# Altium schematic sheet [08]-PumpDriverUnit.SchDoc: RS232 and RS422/RS485 (part 3 of 3)
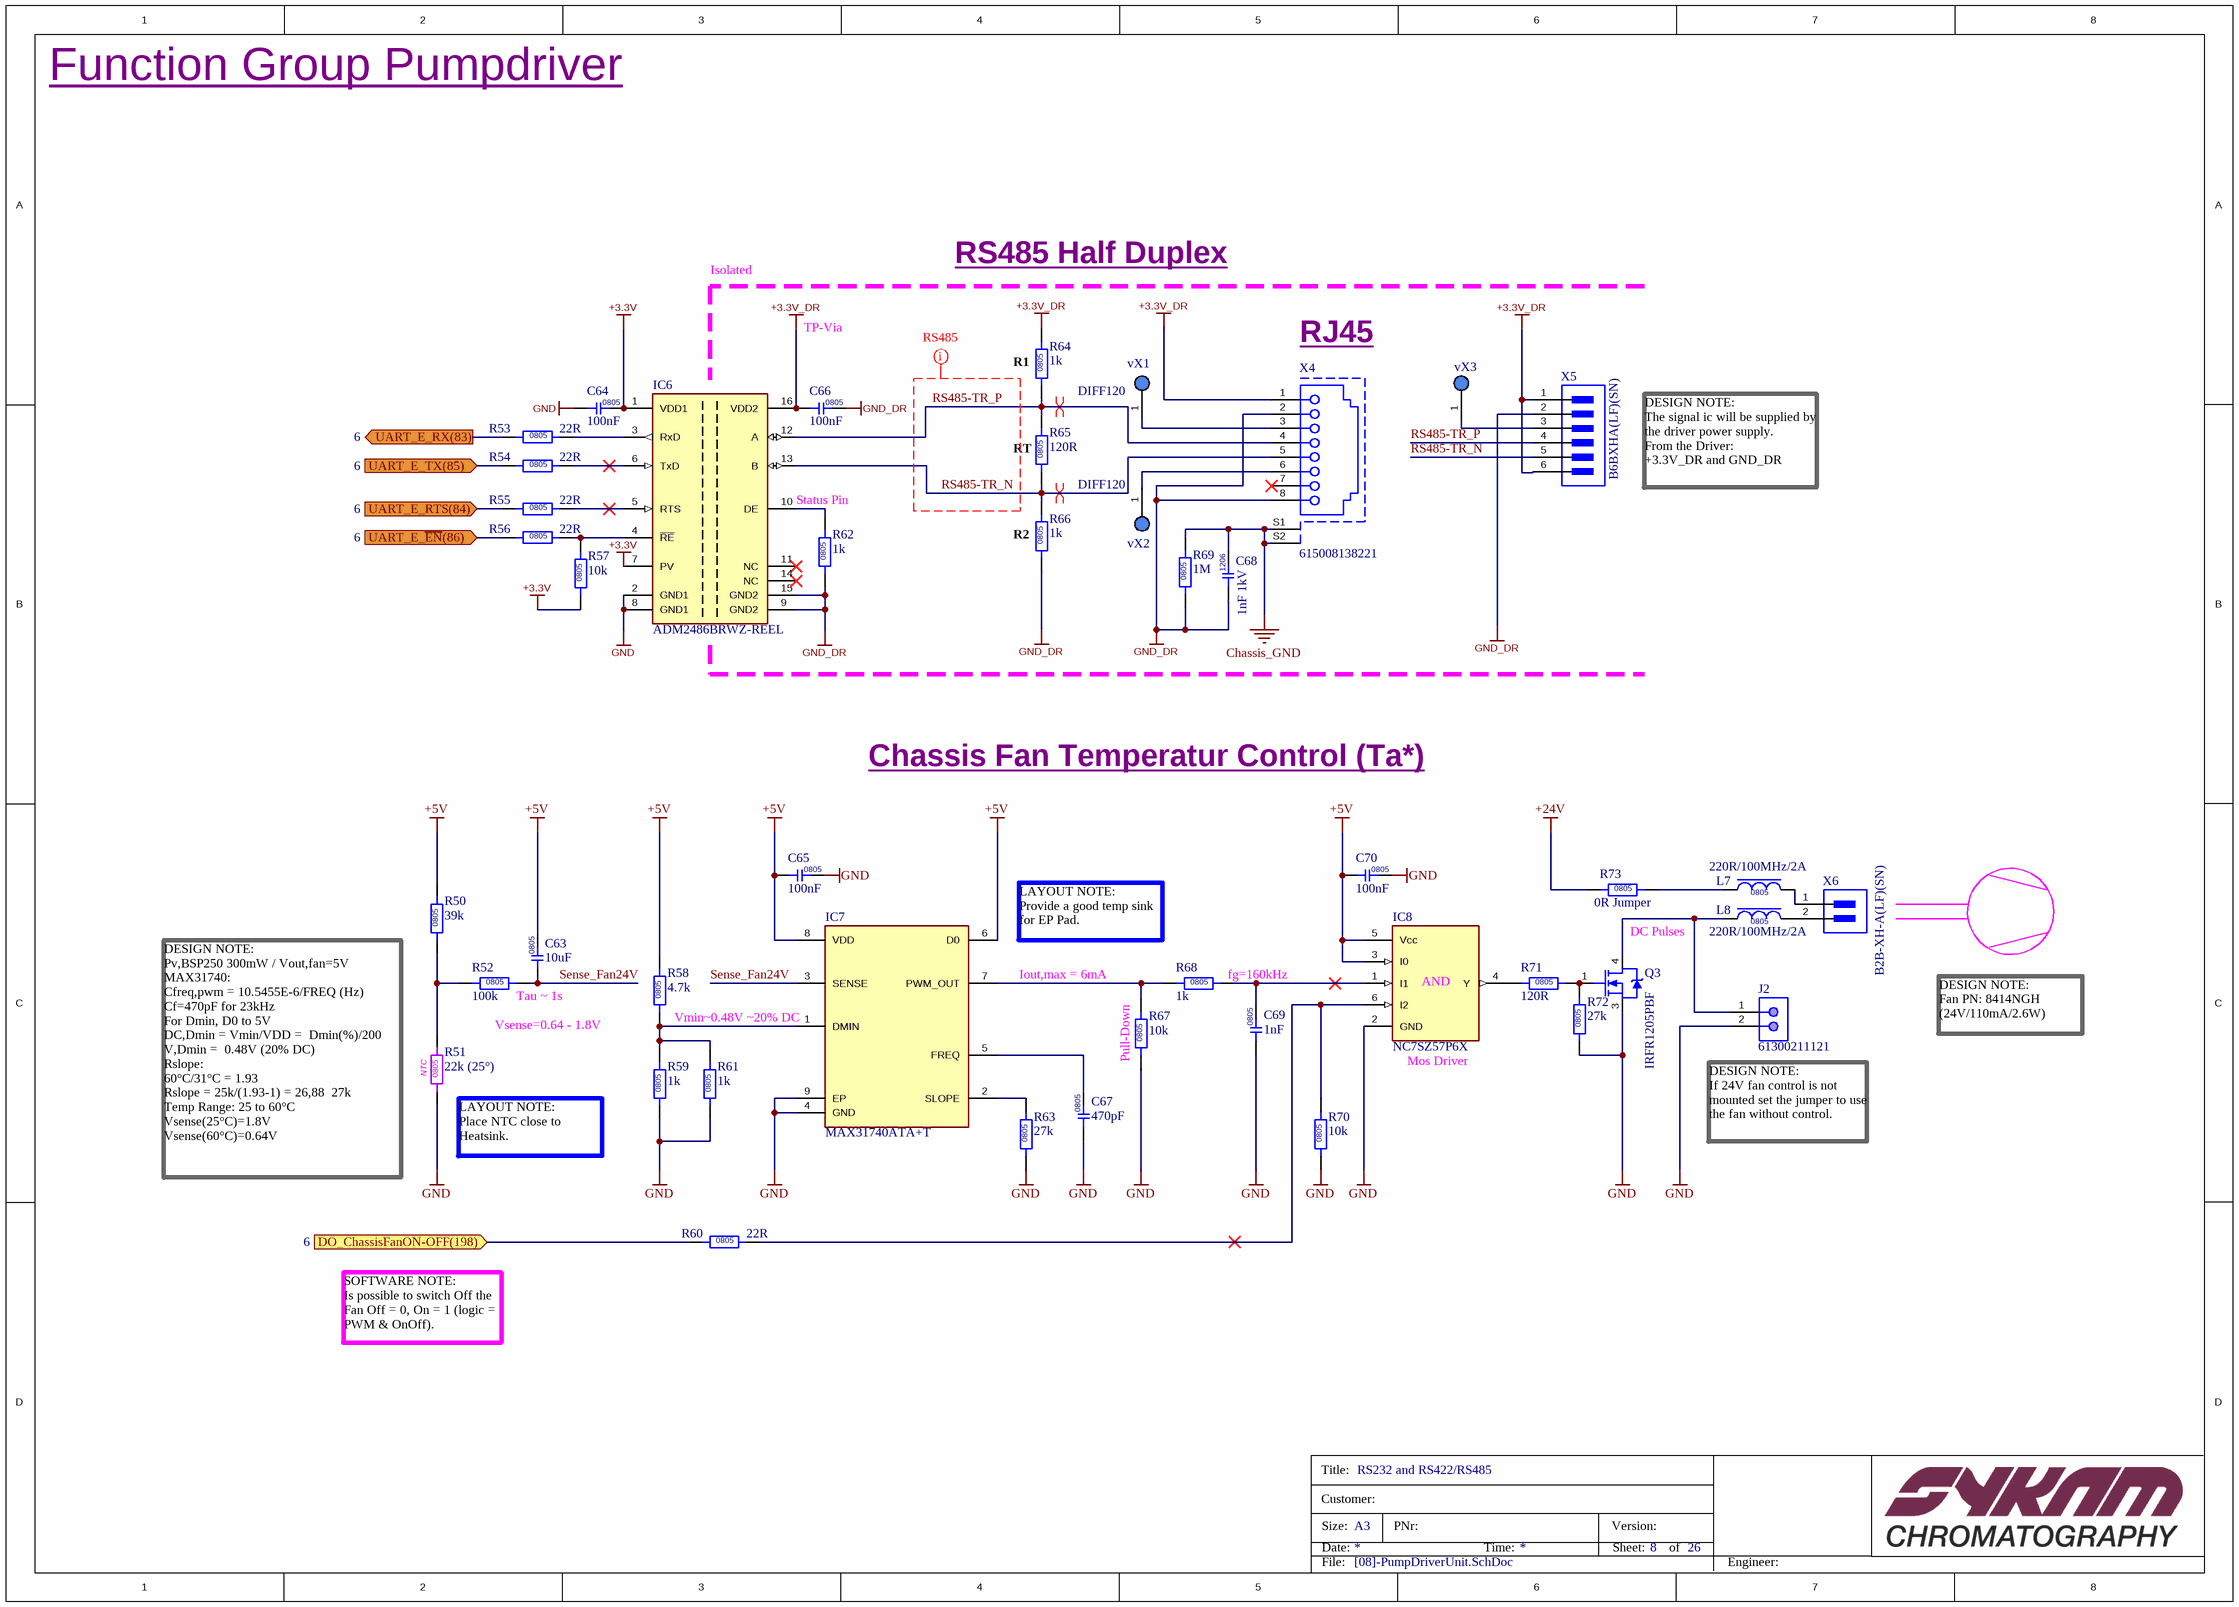
[diagram p2: [08]-PumpDriverUnit.SchDoc]

## Library data of the parts (continued)
R65 = R_120R_RC0805FR-07120RL: RES SMD 120 OHM 1% 1/8W 0805; Manufacturer: Yageo; Temperature Coefficient: 100ppm/°C; Power Rating: 125mW; Voltage Rating: 150V; Supplier 1: Digi-Key; Manufacturer Part Number: RC0805FR-07120RL; RoHS: Yes; Category: Chip SMD Resistors; Case/Package: 0805; Case Code (Metric): 2012; Case Code (Imperial): 0805; Min Operating Temperature: -55°C; Max Operating Temperature: 155°C; Resistance: 120R; Tolerance: 1%; Packaging: Tape and Reel; Composition: Thick Film; Package Quantity: 1; Number of Terminations: 2; Termination: SMD/SMT; Military Standard: Not; Max Power Dissipation: 125mW; Features: Moisture Resistant; Length: 2mm; Height: 0.5mm; Width: 0.049inch; Depth: 1.25mm; REACH SVHC: Unknown; Lead Free: Lead Free; ComponentLink1URL: https://datasheet.ciiva.com/11819/0900766b8106beab-11819786.pdf?src-supplier=RSComponents; ComponentLink1Description: https://datasheet.ciiva.com/11819/0900766b8106beab-11819786.pdf?src-supplier=RSComponents; ComponentLink2URL: https://datasheet.ciiva.com/2491/pyu-r-int-thick-7-2491586.pdf?src-supplier=Digi-Key; ComponentLink2Description: https://datasheet.ciiva.com/2491/pyu-r-int-thick-7-2491586.pdf?src-supplier=Digi-Key; ComponentLink3URL: https://datasheet.ciiva.com/7941/444164-7941691.pdf?src-supplier=Element14; ComponentLink3Description: https://datasheet.ciiva.com/7941/444164-7941691.pdf?src-supplier=Element14; ComponentLink4URL: https://datasheet.ciiva.com/16964/rc0805-16964606.pdf?src-supplier=Future+Electronics; ComponentLink4Description: https://datasheet.ciiva.com/16964/rc0805-16964606.pdf?src-supplier=Future+Electronics; ComponentLink5URL: https://datasheet.ciiva.com/2491/pyu-r-int-thick-7-2491585.pdf?src-supplier=Digi-Key; ComponentLink5Description: https://datasheet.ciiva.com/2491/pyu-r-int-thick-7-2491585.pdf?src-supplier=Digi-Key; ComponentLink6URL: https://datasheet.ciiva.com/2491/pyu-r-int-thick-7-2491587.pdf?src-supplier=Digi-Key; ComponentLink6Description: https://datasheet.ciiva.com/2491/pyu-r-int-thick-7-2491587.pdf?src-supplier=Digi-Key; ComponentLink7URL: https://datasheet.ciiva.com/12558/rc0805-257173-12558661.pdf?src-supplier=Mouser; ComponentLink7Description: https://datasheet.ciiva.com/12558/rc0805-257173-12558661.pdf?src-supplier=Mouser; ComponentLink8URL: https://datasheet.ciiva.com/7941/444164-7941692.pdf?src-supplier=Element14; ComponentLink8Description: https://datasheet.ciiva.com/7941/444164-7941692.pdf?src-supplier=Element14; Supplier Part Number 1: 311-120CRCT-ND; Stock 1: 633913
R69 = R_1M_RC0805FR-071ML: Res Thick Film 0805 1M Ohm 1% 0.125W(1/8W) ±100ppm/C Epoxy SMD T/R; Manufacturer: Yageo; Temperature Coefficient: 100ppm/°C; Resistance: 1MR; Power Rating: 125mW; Voltage Rating: 150V; Manufacturer Part Number: RC0805FR-071ML; RoHS: Yes; Category: Chip SMD Resistors; Case/Package: 0805; Case Code (Metric): 2012; Case Code (Imperial): 0805; Min Operating Temperature: -55°C; Max Operating Temperature: 155°C; Composition: Thick Film; Tolerance: 1%; Packaging: Tape and Reel; Number of Terminations: 2; Termination: SMD/SMT; Military Standard: Not; Max Power Dissipation: 125mW; Features: Moisture Resistant; Package Quantity: 1; Length: 0.079inch; Height: 0.024inch; Width: 0.049inch; Depth: 1.25mm; REACH SVHC: Unknown; Lead Free: Lead Free; ComponentLink1URL: https://datasheet.ciiva.com/2519/pyu-r-int-thick-7-2519712.pdf?src-supplier=Digi-Key; ComponentLink1Description: https://datasheet.ciiva.com/2519/pyu-r-int-thick-7-2519712.pdf?src-supplier=Digi-Key; ComponentLink2URL: https://datasheet.ciiva.com/12666/rc0805-12666975.pdf?src-supplier=Mouser; ComponentLink2Description: https://datasheet.ciiva.com/12666/rc0805-12666975.pdf?src-supplier=Mouser; ComponentLink3URL: https://datasheet.ciiva.com/2519/pyu-r-int-thick-7-2519713.pdf?src-supplier=Digi-Key; ComponentLink3Description: https://datasheet.ciiva.com/2519/pyu-r-int-thick-7-2519713.pdf?src-supplier=Digi-Key; ComponentLink4URL: https://datasheet.ciiva.com/2519/pyu-r-int-thick-7-2519711.pdf?src-supplier=Digi-Key; ComponentLink4Description: https://datasheet.ciiva.com/2519/pyu-r-int-thick-7-2519711.pdf?src-supplier=Digi-Key; ComponentLink5URL: https://datasheet.ciiva.com/17419/rc0805-17419909.pdf?src-supplier=Future+Electronics; ComponentLink5Description: https://datasheet.ciiva.com/17419/rc0805-17419909.pdf?src-supplier=Future+Electronics; Stock 2: 3286221; Pricing 2: 1=0,10000, 10=0,04000, 100=0,01630, 1000=0,00731, 2500=0,00635 (USD); Mount: Surface Mount; Number of Pins: 2; Voltage Rating (DC): 150V; ComponentLink6URL: http://www.farnell.com/datasheets/2167052.pdf?src-supplier=Farnell; ComponentLink6Description: http://www.farnell.com/datasheets/2167052.pdf?src-supplier=Farnell; ComponentLink7URL: http://www.mouser.com/ds/2/447/Yageo_08112016_RC0805-968729.pdf?src-supplier=Mouser; ComponentLink7Description: http://www.mouser.com/ds/2/447/Yageo_08112016_RC0805-968729.pdf?src-supplier=Mouser; ComponentLink8URL: http://www.farnell.com/datasheets/444164.pdf?src-supplier=Element14; ComponentLink8Description: http://www.farnell.com/datasheets/444164.pdf?src-supplier=Element14; ComponentLink9URL: http://www.farnell.com/datasheets/2167052.pdf?src-supplier=Newark; ComponentLink9Description: http://www.farnell.com/datasheets/2167052.pdf?src-supplier=Newark; ComponentLink10URL: http://www.yageo.com/documents/recent/PYu-RC_Group_51_RoHS_L_10.pdf?src-supplier=Digi-Key; ComponentLink10Description: http://www.yageo.com/documents/recent/PYu-RC_Group_51_RoHS_L_10.pdf?src-supplier=Digi-Key; Supplier 1: Digi-Key; Supplier Part Number 1: 311-1.00MCRCT-ND
R71 = R_120R_RC0805FR-07120RL: RES SMD 120 OHM 1% 1/8W 0805; Manufacturer: Yageo; Temperature Coefficient: 100ppm/°C; Power Rating: 125mW; Voltage Rating: 150V; PCBChecked: initials after Checked; Supplier 1: Digi-Key; Manufacturer Part Number: RC0805FR-07120RL; RoHS: Yes; Category: Chip SMD Resistors; Case/Package: 0805; Case Code (Metric): 2012; Case Code (Imperial): 0805; Min Operating Temperature: -55°C; Max Operating Temperature: 155°C; Resistance: 120R; Tolerance: 1%; Packaging: Tape and Reel; Composition: Thick Film; Package Quantity: 1; Number of Terminations: 2; Termination: SMD/SMT; Military Standard: Not; Max Power Dissipation: 125mW; Features: Moisture Resistant; Length: 2mm; Height: 0.5mm; Width: 0.049inch; Depth: 1.25mm; REACH SVHC: Unknown; Lead Free: Lead Free; ComponentLink1URL: https://datasheet.ciiva.com/11819/0900766b8106beab-11819786.pdf?src-supplier=RSComponents; ComponentLink1Description: https://datasheet.ciiva.com/11819/0900766b8106beab-11819786.pdf?src-supplier=RSComponents; ComponentLink2URL: https://datasheet.ciiva.com/2491/pyu-r-int-thick-7-2491586.pdf?src-supplier=Digi-Key; ComponentLink2Description: https://datasheet.ciiva.com/2491/pyu-r-int-thick-7-2491586.pdf?src-supplier=Digi-Key; ComponentLink3URL: https://datasheet.ciiva.com/7941/444164-7941691.pdf?src-supplier=Element14; ComponentLink3Description: https://datasheet.ciiva.com/7941/444164-7941691.pdf?src-supplier=Element14; ComponentLink4URL: https://datasheet.ciiva.com/16964/rc0805-16964606.pdf?src-supplier=Future+Electronics; ComponentLink4Description: https://datasheet.ciiva.com/16964/rc0805-16964606.pdf?src-supplier=Future+Electronics; ComponentLink5URL: https://datasheet.ciiva.com/2491/pyu-r-int-thick-7-2491585.pdf?src-supplier=Digi-Key; ComponentLink5Description: https://datasheet.ciiva.com/2491/pyu-r-int-thick-7-2491585.pdf?src-supplier=Digi-Key; ComponentLink6URL: https://datasheet.ciiva.com/2491/pyu-r-int-thick-7-2491587.pdf?src-supplier=Digi-Key; ComponentLink6Description: https://datasheet.ciiva.com/2491/pyu-r-int-thick-7-2491587.pdf?src-supplier=Digi-Key; ComponentLink7URL: https://datasheet.ciiva.com/12558/rc0805-257173-12558661.pdf?src-supplier=Mouser; ComponentLink7Description: https://datasheet.ciiva.com/12558/rc0805-257173-12558661.pdf?src-supplier=Mouser; ComponentLink8URL: https://datasheet.ciiva.com/7941/444164-7941692.pdf?src-supplier=Element14; ComponentLink8Description: https://datasheet.ciiva.com/7941/444164-7941692.pdf?src-supplier=Element14; Supplier Part Number 1: 311-120CRCT-ND; Stock 1: 633913; IPC7352C: done; SCHChecked: Initials after checked
R73 = R_0R_RMCF0805ZT0R00: STACKPOLE ELECTRONICS - RMCF0805ZT0R00. - RES THKFLM 0805 0 OHM JUMPER 1/8W 200PPM/ C SMD ROHS COMPLIANT: YES; Resistance: 0mR; Power Rating: 125mW; PCBChecked: initials after Checked; Supplier 1: Digi-Key; Manufacturer Part Number: RMCF0805ZT0R00; RoHS: Yes; Category: Chip SMD Resistors; Mount: Surface Mount; Case/Package: 0805; Case Code (Metric): 2012; Case Code (Imperial): 0805; Contact Plating: Tin,Matte; Min Operating Temperature: -55°C; Max Operating Temperature: 155°C; Packaging: Tape and Reel; Features: Automotive AEC-Q200; Composition: Thick Film; Number of Terminations: 2; Military Standard: Not; Max Power Dissipation: 125mW; Length: 2mm; Height: 0.026inch; Width: 0.049inch; Depth: 1.25mm; Radiation Hardening: No; Lead Free: Lead Free; ComponentLink1URL: https://datasheet.ciiva.com/15193/getdatasheetpartid-360417-15193658.pdf?src-supplier=Verical; ComponentLink1Description: https://datasheet.ciiva.com/15193/getdatasheetpartid-360417-15193658.pdf?src-supplier=Verical; Supplier Part Number 1: RMCF0805ZT0R00CT-ND; Manufacturer: Stackpole Electronics; Stock 1: 361289; IPC7352C: done; SCHChecked: Initials after checked
vX1-vX3 = Reserve-Kontakt-T/B-Layer: Via Reserve Kontakt
X4 = CON-615008138221: WURTH ELEKTRONIK - 615008138221 - JACK, RJ45, VERT, 8P8C, SHIELDED; Manufacturer: Wurth Electronics; Number of Ports: 1; Direction: User Selectable; Connector Type: Jack,RJ45,Socket; Number of Contacts: 8; Gender: Female; Current Rating: 1.5A; Mating Cycles: 500; Voltage Rating: 125V; Supplier 1: Digi-Key; Manufacturer Part Number: 615008138221; RoHS: Yes; Category: Connectors; Mount: Through Hole; Contact Material: Copper Alloy,Copper; Housing Material: PBT; Contact Plating: Gold; Color: Black; Min Operating Temperature: -40°C; Max Operating Temperature: 85°C; Termination: Through Hole; Package Quantity: 80; Number of Rows: 1; Shielding: Shielded; Packaging: Tray; Number of Positions: 8; Orientation: Vertical; Length: 16.65mm; Height: 16.65mm; Depth: 16.4mm; Width: 15.9mm; REACH SVHC: Unknown; ComponentLink1URL: https://datasheet.ciiva.com/685/615008138221-685840.pdf?src-supplier=Digi-Key; ComponentLink1Description: https://datasheet.ciiva.com/685/615008138221-685840.pdf?src-supplier=Digi-Key; ComponentLink2URL: https://datasheet.ciiva.com/11726/0900766b80f88675-11726117.pdf?src-supplier=RSComponents; ComponentLink2Description: https://datasheet.ciiva.com/11726/0900766b80f88675-11726117.pdf?src-supplier=RSComponents; ComponentLink3URL: https://datasheet.ciiva.com/4561/615008138221-83706-4561590.pdf?src-supplier=Mouser; ComponentLink3Description: https://datasheet.ciiva.com/4561/615008138221-83706-4561590.pdf?src-supplier=Mouser; ComponentLink4URL: https://datasheet.ciiva.com/1108/1666696-1108142.pdf?src-supplier=Element14; ComponentLink4Description: https://datasheet.ciiva.com/1108/1666696-1108142.pdf?src-supplier=Element14; ComponentLink5URL: https://datasheet.ciiva.com/48689/001088217-da-01-en-wr-com-modular-jack-615008138221-48689543.pdf?src-supplier=Conrad; ComponentLink5Description: https://datasheet.ciiva.com/48689/001088217-da-01-en-wr-com-modular-jack-615008138221-48689543.pdf?src-supplier=Conrad; Supplier Part Number 1: 732-2743-ND; Stock 1: 4282
X5 = CON_6pol_B6BXHA(LF)(SN): CONN HEADER VERT 6POS 2.5MM; Manufacturer: JST; Current Rating: 3A; Number of Positions: 6; Contact Resistance: 20mR; Max Voltage Rating (AC): 250V; Connector Type: Male Pin; Insulation Resistance: 1GR; Wire/Cable Gauge: 22AWG; Supplier 1: Digi-Key; Manufacturer Part Number: B6BXHA(LF)(SN); RoHS: Yes; Category: FFC / FPC; Mount: Through Hole; Contact Plating: Tin,Lead,Copper; Contact Material: Brass; Color: Natural; Housing Color: White; Housing Material: Polyamide; Min Operating Temperature: -25°C; Max Operating Temperature: 85°C; Termination: Press-Fit; Number of Rows: 1; Max Current Rating: 3A; Packaging: Bulk; Orientation: Straight; Voltage Rating (AC): 250V; Voltage Rating: 250V; Number of Contacts: 6; Max Voltage Rating (DC): 250V; Package Quantity: 500; Length: 17.4mm; Pitch: 2.5mm; Depth: 5.75mm; Lead Pitch: 2.5mm; Lead Free: Lead Free; REACH SVHC: No SVHC; ComponentLink1URL: https://datasheet.ciiva.com/26894/getdatasheetpartid-424647-26894806.pdf?src-supplier=Verical; ComponentLink1Description: https://datasheet.ciiva.com/26894/getdatasheetpartid-424647-26894806.pdf?src-supplier=Verical; ComponentLink2URL: https://datasheet.ciiva.com/26894/getdatasheetpartid-641012-26894489.pdf?src-supplier=Verical; ComponentLink2Description: https://datasheet.ciiva.com/26894/getdatasheetpartid-641012-26894489.pdf?src-supplier=Verical; ComponentLink3URL: https://datasheet.ciiva.com/20207/523653-20207177.pdf?src-supplier=Rapid+Electronics; ComponentLink3Description: https://datasheet.ciiva.com/20207/523653-20207177.pdf?src-supplier=Rapid+Electronics; ComponentLink4URL: https://datasheet.ciiva.com/16397/b6b-xh-alfsn-16397116.pdf?src-supplier=Future+Electronics; ComponentLink4Description: https://datasheet.ciiva.com/16397/b6b-xh-alfsn-16397116.pdf?src-supplier=Future+Electronics; ComponentLink5URL: https://datasheet.ciiva.com/712/exh-712511.pdf?src-supplier=Digi-Key; ComponentLink5Description: https://datasheet.ciiva.com/712/exh-712511.pdf?src-supplier=Digi-Key; Supplier Part Number 1: 455-2271-ND
X6 = CON_2p_B2B-XH-A(LF)(SN): Conn Shrouded Header (4 Sides) HDR 2 POS 2.5mm Solder ST Thru-Hole Box; Manufacturer: JST; Number of Positions: 2; Connector Type: Male Pin; Current Rating: 3A; Contact Resistance: 20mR; Voltage Rating: 250V; Insulation Resistance: 1GR; Wire/Cable Gauge: 22AWG; Supplier 1: Farnell; Manufacturer Part Number: B2B-XH-A(LF)(SN); RoHS: Yes; Category: FFC / FPC; Stock 1: 138104; Pricing 1: 100=0,06890, 1000=0,06030, 2500=0,05600, 5000=0,05160, 10000=0,05030, 20000=0,04930 (EUR); Mount: Through Hole; Contact Plating: Tin,Copper,Lead; Color: Natural; Contact Material: Brass; Housing Color: White; Housing Material: Polyamide; Min Operating Temperature: -25°C; Max Operating Temperature: 85°C; Number of Rows: 1; Packaging: Bulk; Termination: Solder; Fastening Type: Detent; Max Current Rating: 3A; Voltage Rating (AC): 250V; Max Voltage Rating (AC): 250V; Number of Contacts: 2; Max Voltage Rating (DC): 250V; Orientation: Straight; Length: 7.4mm; Pitch: 2.5mm; Lead Pitch: 2.5mm; Depth: 5.75mm; REACH SVHC: No SVHC; Lead Free: Lead Free; ComponentLink1URL: https://datasheet.ciiva.com/26894/getdatasheetpartid-640357-26894434.pdf?src-supplier=Verical; ComponentLink1Description: https://datasheet.ciiva.com/26894/getdatasheetpartid-640357-26894434.pdf?src-supplier=Verical; ComponentLink2URL: https://datasheet.ciiva.com/11746/0900766b8082653e-11746979.pdf?src-supplier=RSComponents; ComponentLink2Description: https://datasheet.ciiva.com/11746/0900766b8082653e-11746979.pdf?src-supplier=RSComponents; ComponentLink3URL: https://datasheet.ciiva.com/26894/getdatasheetpartid-385291-26894760.pdf?src-supplier=Verical; ComponentLink3Description: https://datasheet.ciiva.com/26894/getdatasheetpartid-385291-26894760.pdf?src-supplier=Verical; ComponentLink4URL: https://datasheet.ciiva.com/8052/5448-8052024.pdf?src-supplier=Element14; ComponentLink4Description: https://datasheet.ciiva.com/8052/5448-8052024.pdf?src-supplier=Element14; ComponentLink5URL: https://datasheet.ciiva.com/20207/523653-20207167.pdf?src-supplier=Rapid+Electronics; ComponentLink5Description: https://datasheet.ciiva.com/20207/523653-20207167.pdf?src-supplier=Rapid+Electronics; Supplier Part Number 1: 1516276